# EAGLE design cortina (EAGLE 9.6.2)
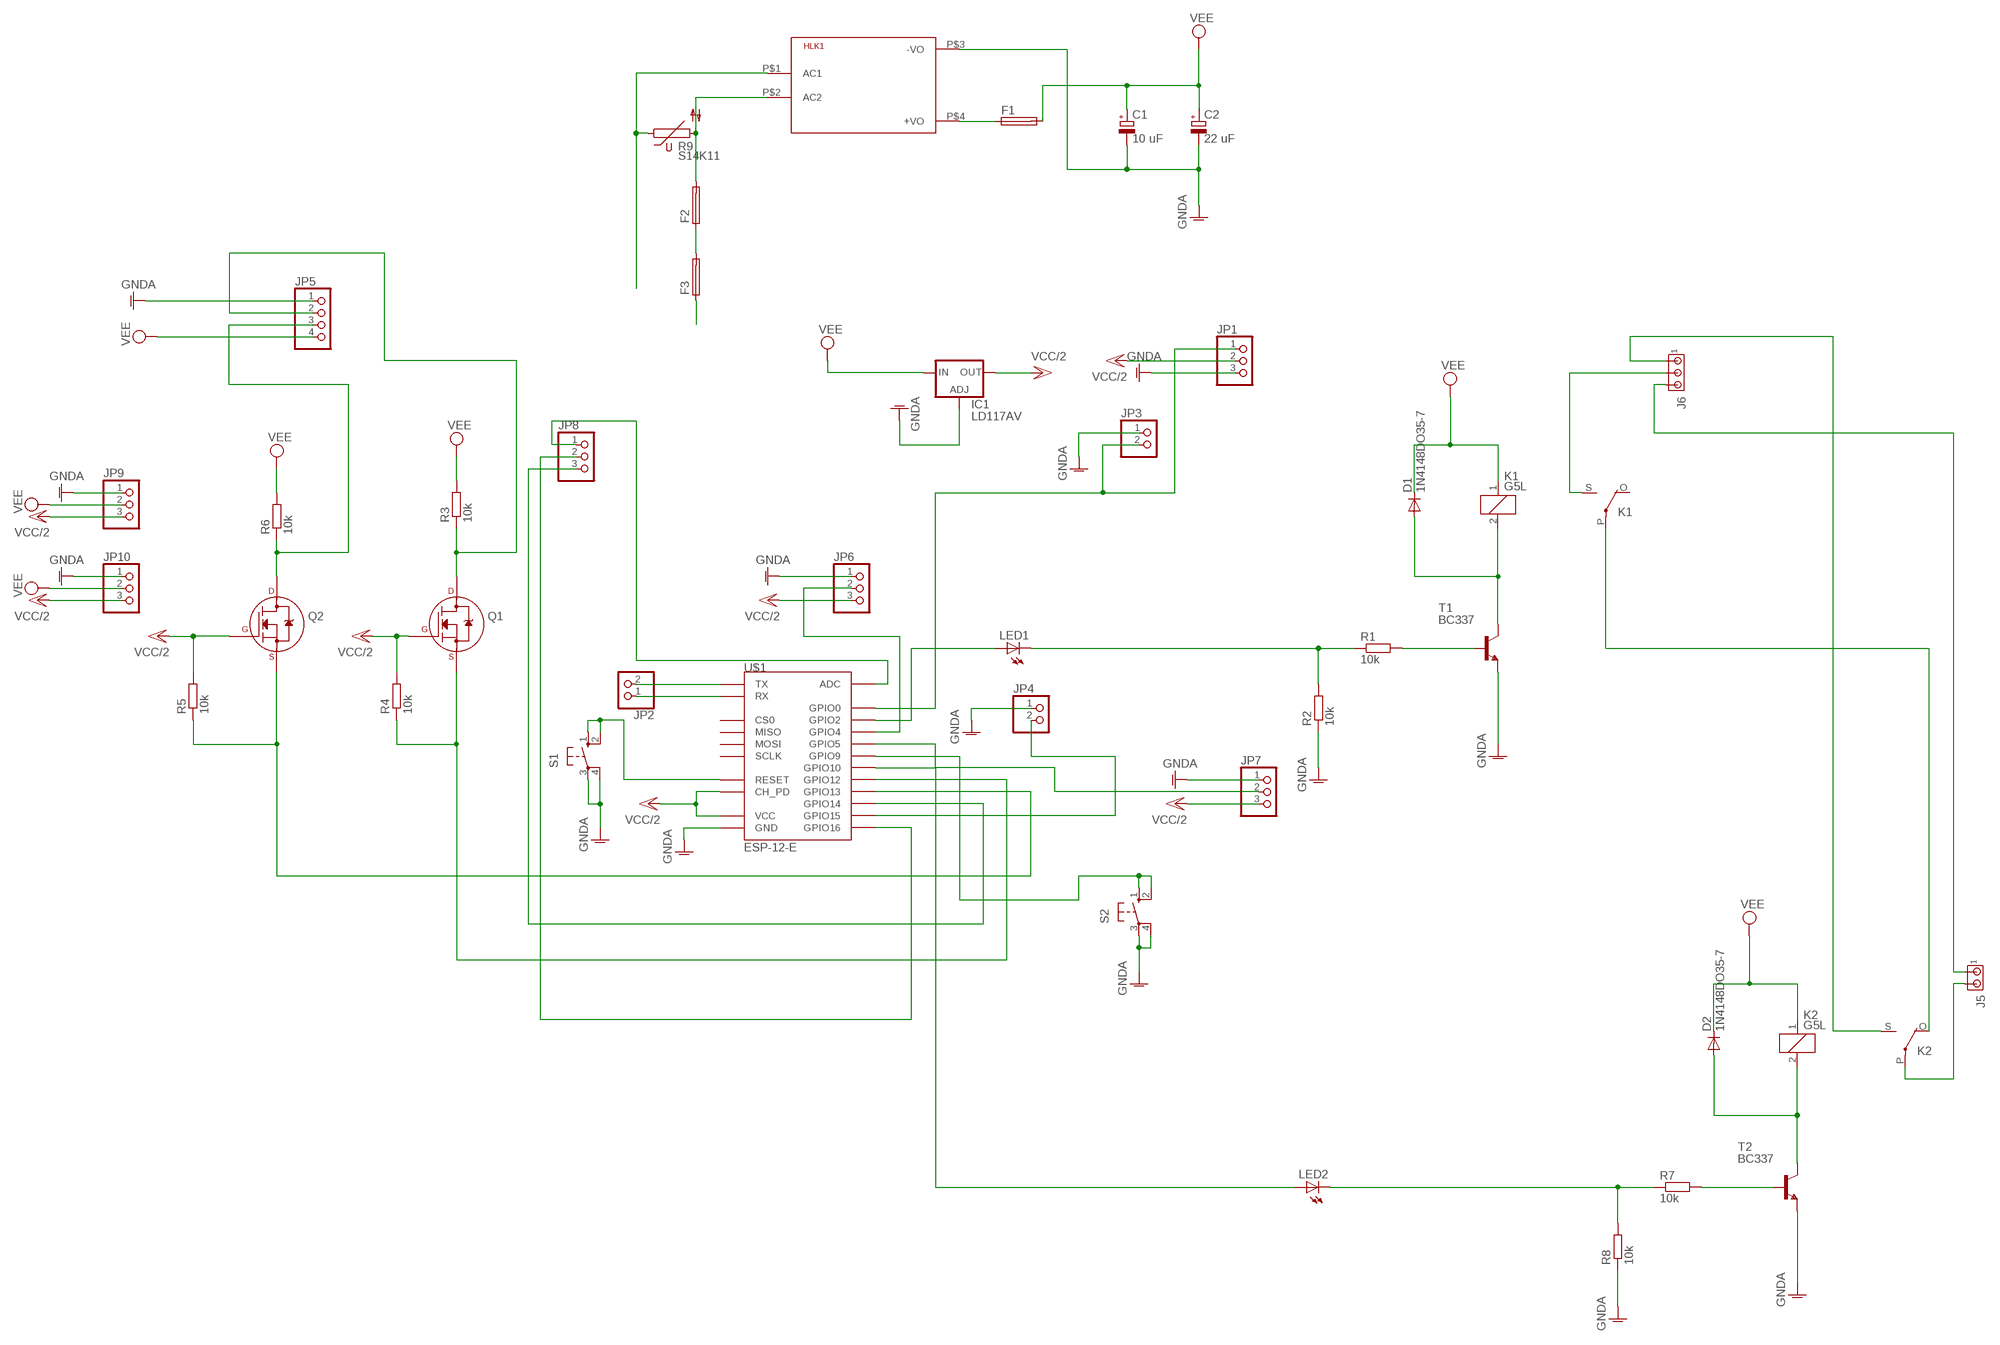
[diagram p0: schematic, sheet 1]

## Parts
C1  10 uF  CPOL-EUE1.8-4  [E1,8-4]
C2  22 uF  CPOL-EUE1.8-4  [E1,8-4]
D1  1N4148DO35-7  [DO35-7]
D2  1N4148DO35-7  [DO35-7]
F1  GSH15  [GSH15]
F2  GSH15  [GSH15]
F3  GSH15  [GSH15]
HLK1  HLK-PM013W  [HLK-PM01]
IC1  LD117AV  [TO220L1]
J5  MTA02-156  [1X2MTA]
J6  MTA03-156  [1X3MTA]
JP1  PINHD-1X3  [1X03]
JP2  PINHD-1X2  [1X02]
JP3  PINHD-1X2  [1X02]
JP4  PINHD-1X2  [1X02]
JP5  PINHD-1X4  [1X04]
JP6  PINHD-1X3  [1X03]
JP7  PINHD-1X3  [1X03]
JP8  PINHD-1X3  [1X03]
JP9  PINHD-1X3  [1X03]
JP10  PINHD-1X3  [1X03]
K1  G5L  [G5LE]
K2  G5L  [G5LE]
LED1  LED5MM  [LED5MM]
LED2  LED5MM  [LED5MM]
Q1  2N7002_TO92  [TO-92]
Q2  2N7002_TO92  [TO-92]
R1  10k  R-EU_0207/7  [0207/7]
R2  10k  R-EU_0207/7  [0207/7]
R3  10k  R-EU_0207/7  [0207/7]
R4  10k  R-EU_0207/7  [0207/7]
R5  10k  R-EU_0207/7  [0207/7]
R6  10k  R-EU_0207/7  [0207/7]
R7  10k  R-EU_0207/7  [0207/7]
R8  10k  R-EU_0207/7  [0207/7]
R9  S14K11  [S14K11]
S1  10-XX  [B3F-10XX]
S2  10-XX  [B3F-10XX]
T1  BC337  [TO92]
T2  BC337  [TO92]
U$1  ESP-12-E  [ESP-12-E]

## Nets
GNDA: C1.- C2.- HLK1.P$3(-VO) IC1.1(ADJ) JP1.3 JP3.1 JP4.1 JP5.1 JP6.1 JP7.1 JP9.1 JP10.1 R2.1 R8.1 S1.3(P) S1.4(P1) S2.3(P) S2.4(P1) T1.1(E) T2.1(E) U$1.GND
N$1 [power]: HLK1.P$1(AC1) J5.1 J6.3 R9.1
N$2: LED1.A U$1.GPIO2
N$3: JP1.1 JP3.2 U$1.GPIO0
N$4: LED1.K(C) R1.1 R2.2
N$5: JP2.2 U$1.TX
N$6: D1.A K1.2 T1.3(C)
N$7: R1.2 T1.2(B)
N$8: J6.2 K1.S(2:S)
N$9 [power]: K1.P(2:P) K2.O(2:O)
N$10: JP2.1 U$1.RX
N$11: Q1.1(S) R4.1 U$1.GPIO12
N$12: JP5.2 Q1.3(D) R3.1
N$13: D2.A K2.2 T2.3(C)
N$14: Q2.1(S) R5.1 U$1.GPIO13
N$15: JP5.3 Q2.3(D) R6.1
N$16: JP4.2 U$1.GPIO15
N$17: JP6.2 U$1.GPIO4
N$18: JP7.2 LED2.A U$1.GPIO5 U$1.GPIO10
N$19: JP8.1 U$1.ADC
N$20: JP8.3 U$1.GPIO14
N$21: JP8.2 U$1.GPIO16
N$22: R7.2 T2.2(B)
N$23: F1.1 HLK1.P$4(+VO)
N$24: J6.1 K2.S(2:S)
N$25 [power]: F3.1 J5.2 K2.P(2:P)
N$26: LED2.K(C) R7.1 R8.2
N$27: F2.1 F3.2
N$28: F2.2 HLK1.P$2(AC2) R9.2
N$29: S1.1(S) S1.2(S1) U$1.RESET
N$32: S2.1(S) S2.2(S1) U$1.GPIO9
VCC/2: IC1.2(OUT) JP1.2 JP6.3 JP7.3 JP9.3 JP10.3 Q1.2(G) Q2.2(G) R4.2 R5.2 U$1.CH_PD U$1.VCC
VEE: C1.+ C2.+ D1.C D2.C F1.2 IC1.3(IN) JP5.4 JP9.2 JP10.2 K1.1 K2.1 R3.2 R6.2
Unconnected: K1.O(2:O) U$1.CS0 U$1.MISO U$1.MOSI U$1.SCLK

## Library data of the parts
C1 C2 = rcl:CPOL-EU: POLARIZED CAPACITOR, European symbol; SPICEPREFIX: C
D1 D2 = diode:1N4148: DIODE high speed (Philips)
F1-F3 = fuse:GSH15: FUSE HOLDER grid 15mm, 19649 Wickmann; MPN: 64900001039; OC_FARNELL: 1271673; OC_NEWARK: 02P0318
HLK1 = HLK-PM01:HLK-PM01: Hi-Link Power Supply HLK-PM01 3W Author: Ahmed Said <https://github.com/AhmedSaid/EAGLELibraries>
IC1 = v-reg:LD117A?*: Low drop fixed and adjustable positive voltage regulators 1 A Source: http://www.st.com/stonline/products/literature/ds/7194/ld1117axx.pdf
J5 = con-amp:MTA02-156: AMP connector
J6 = con-amp:MTA03-156: AMP connector
JP1 JP6-JP10 = pinhead:PINHD-1X3: PIN HEADER
JP2-JP4 = pinhead:PINHD-1X2: PIN HEADER
JP5 = pinhead:PINHD-1X4: PIN HEADER
K1 K2 = relay:G5L: RELAY 1 x switch, 10 A/120 V AC, 8 A/30 V ADC, Omron; OC_FARNELL: unknown; OC_NEWARK: unknown
LED1 LED2 = adafruit:LED: LED OSRAM: - CHIPLED LG R971, LG N971, LY N971, LG Q971, LY Q971, LO R971, LY R971 LH N974, LH R974 LS Q976, LO Q976, LY Q976 LO Q996 - Hyper CHIPLED LW Q18S LB Q993, LB Q99A, LB R99A - SideLED LS A670, LO A670, LY A670, LG A670, LP A670 LB A673, LV A673, LT A673, LW A673 LH A674 LY A675 LS A676, LA A676, LO A676, LY A676, LW A676 LS A679, LY A679, LG A679 - Hyper Micro SIDELED® LS Y876, LA Y876, LO Y876, LY Y876 LT Y87S - SmartLED LW L88C, LW L88S LB L89C, LB L89S, LG L890 LS L89K, LO L89K, LY L89K LS L896, LA L896, LO L896, LY L896 - TOPLED LS T670, LO T670, LY T670, LG T670, LP T670 LSG T670, LSP T670, LSY T670, LOP T670, LYG T670 LG T671, LOG T671, LSG T671 LB T673, LV T673, LT T673, LW T673 LH T674 LS T676, LA T676, LO T676, LY T676, LB T676, LH T676, LSB T676, LW T676 LB T67C, LV T67C, LT T67C, LS T67K, LO T67K, LY T67K, LW E67C LS E67B, LA E67B, LO E67B, LY E67B, LB E67C, LV E67C, LT E67C LW T67C LS T679, LY T679, LG T679 LS T770, LO T770, LY T770, LG T770, LP T770 LB T773, LV T773, LT T773, LW T773 LH T774 LS E675, LA E675, LY E675, LS T675 LS T776, LA T776, LO T776, LY T776, LB T776 LHGB T686 LT T68C, LB T68C - Hyper Mini TOPLED® LB M676 - Mini TOPLED Santana® LG M470 LS M47K, LO M47K, LY M47K Source: http://www.osram.convergy.de/
Q1 Q2 = transistors:2N700*: 2N7000, 2N7002, NDS7002A N-channel enhancement mode MOSFET
R1-R8 = resistor:R-EU_: RESISTOR, European symbol
R9 = varistor:S14K11: VARISTOR
S1 S2 = switch-omron:10-XX: OMRON SWITCH; MPN: B3F-1000; OC_FARNELL: 176432; OC_NEWARK: 36M3542
T1 T2 = transistor:BC337: NPN TRANSISTOR
U$1 = johs_esp8266_lib_frank_esp12e_mod:ESP-12-E: ESP8266 Wifi Module ESP-12-E; DIMENSIONS: 24.0 x 16.0 mm; PINS: 22; PITCH: 0.078" / 2 mm; SPICEPREFIX: X

## Net classes
1 power: width 1.016 mm

## Board
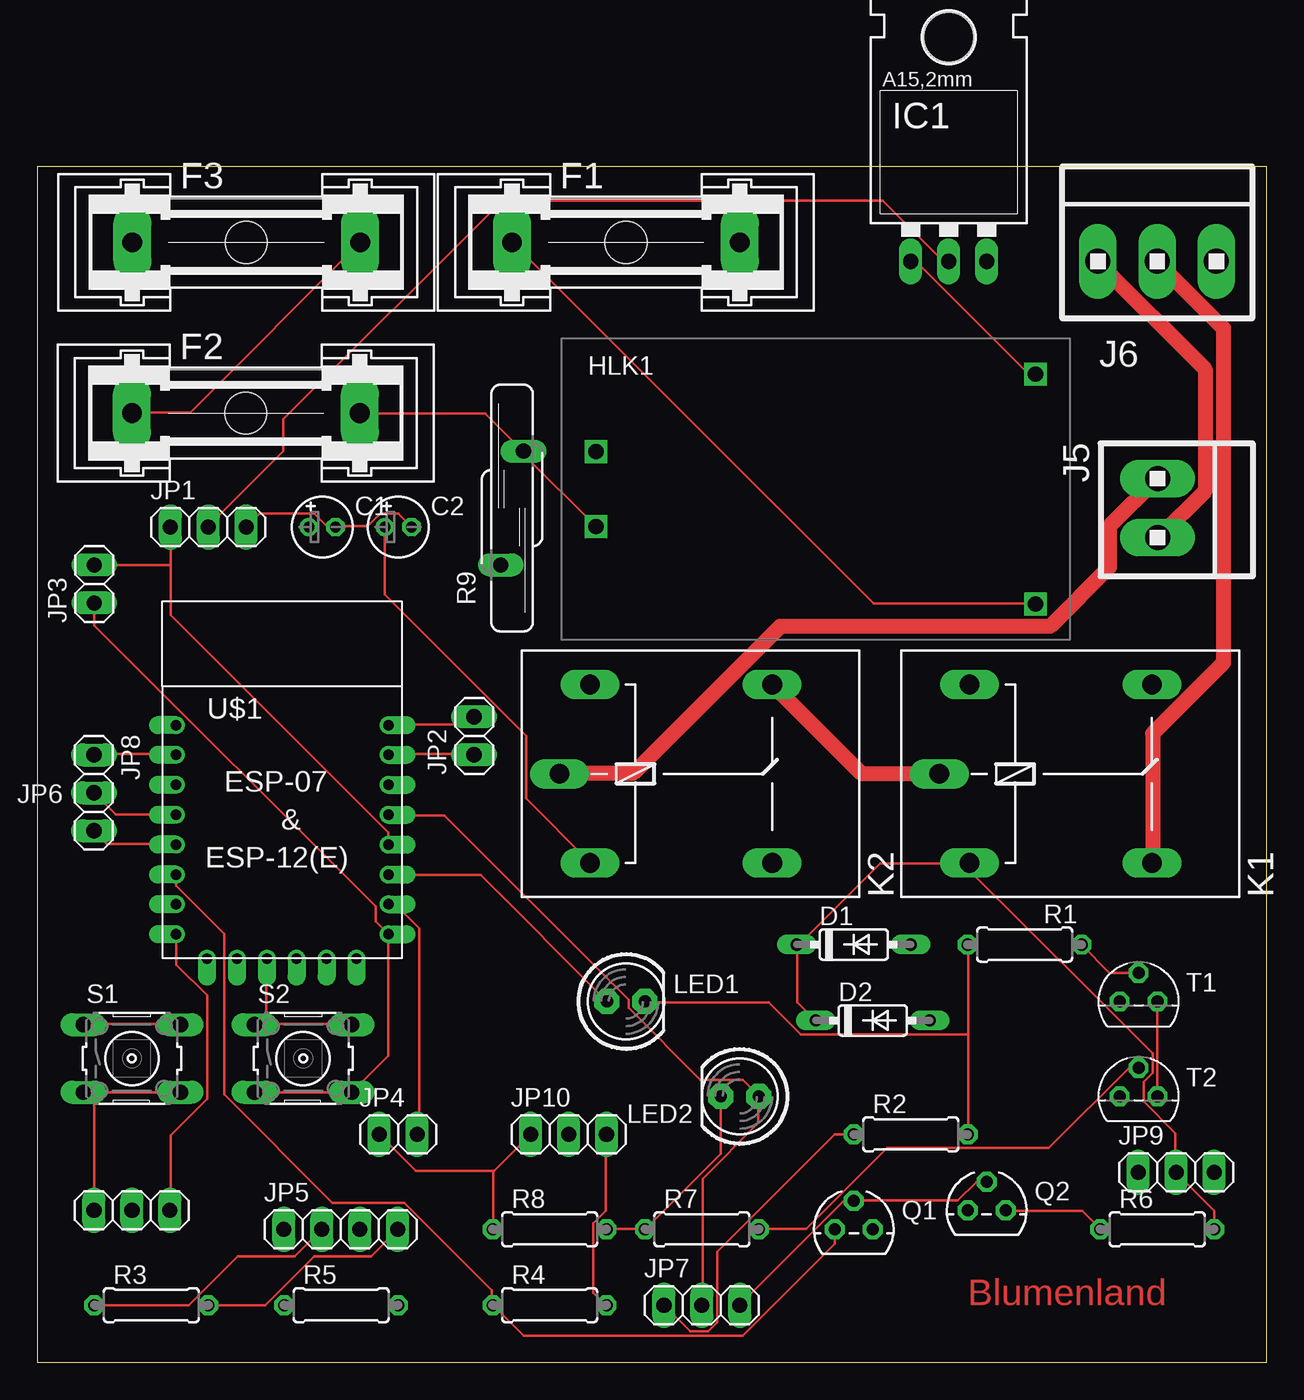
[diagram p1: board, top side]
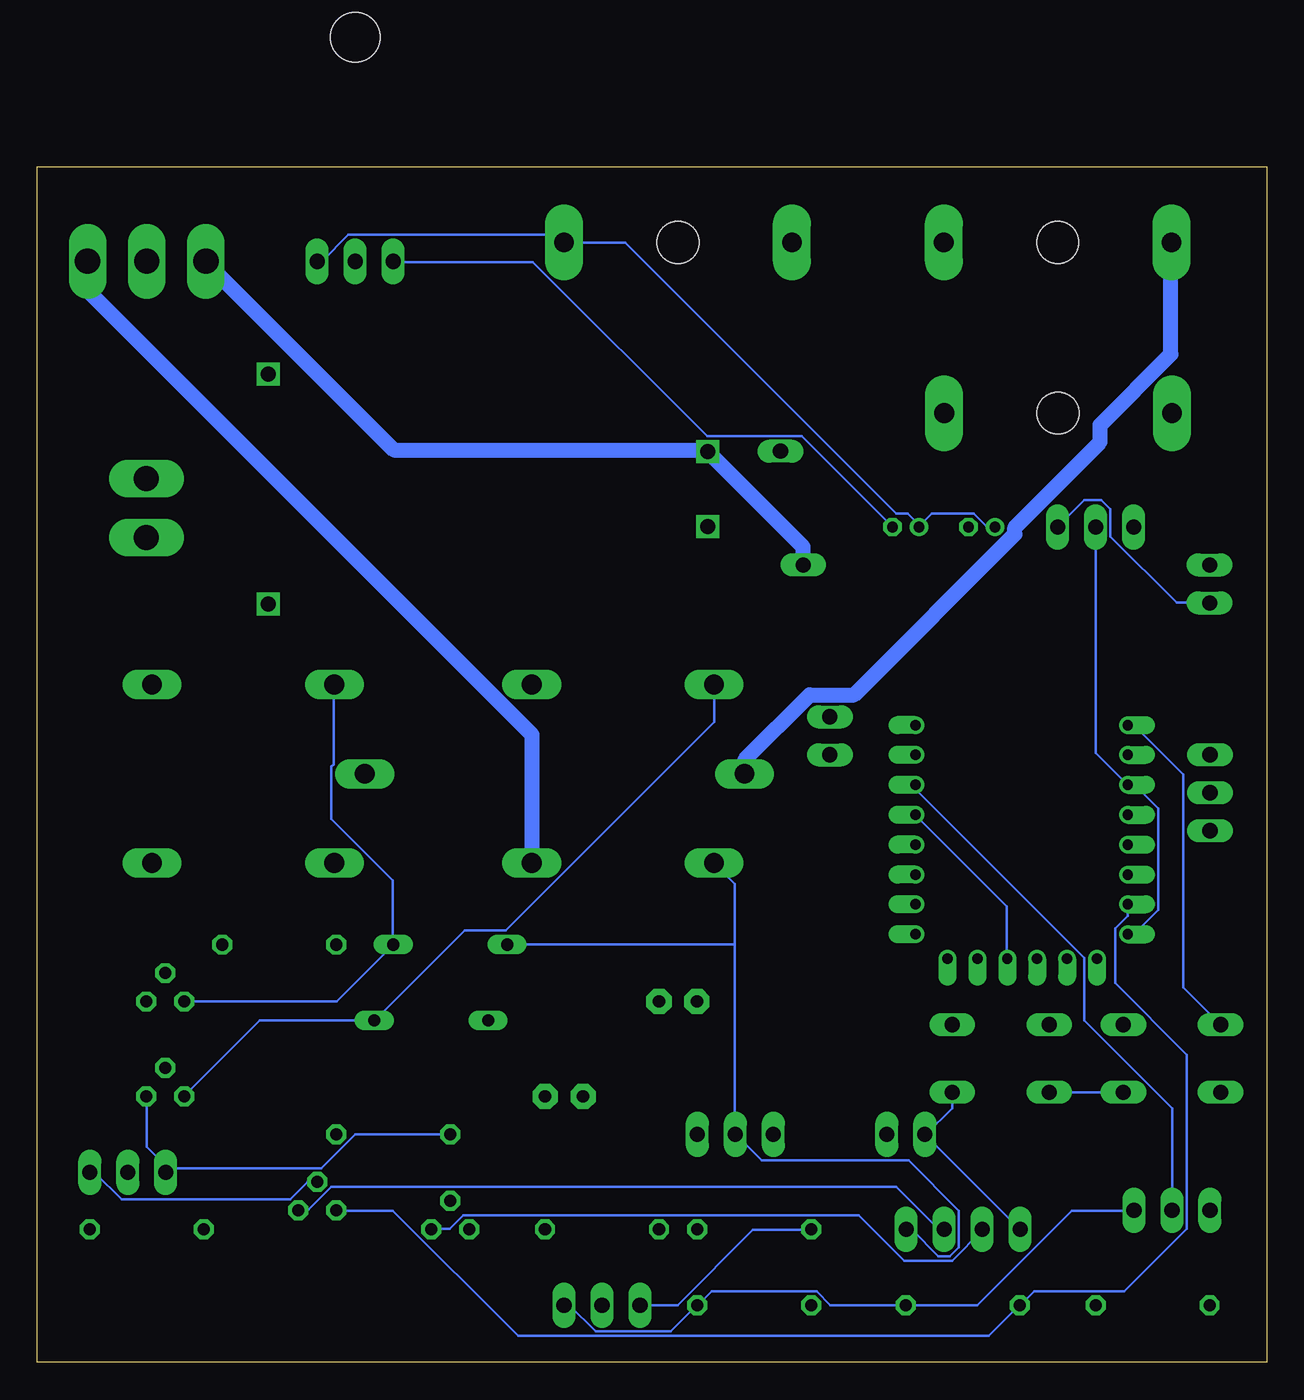
[diagram p2: board, bottom side, seen from below]

Size 82.22 x 80 mm. Coordinates in mm from the lower left corner, seen from the top.
Outline: 0,0 82.22,0 82.22,80 0,80 0,0
Copper layers (1*16): Top 0.035mm / dielectric 1.5mm / Bottom 0.035mm
Design rules "default": minimum track width 6mil, minimum drill 0.35mm, track to track 6mil, track to pad 6mil, pad to pad 6mil, via to via 6mil, smd to smd 6mil, copper to edge 40mil, drill to drill 6mil, minimum pad ring 10mil, minimum via ring 8mil, stop-mask expansion 4mil, vias tented up to drill 0mil, thermal gap 10mil

### Footprints (pad centres in the part's own frame; a part is rotated, then mirrored left to right if it is on the bottom)
E1,8-4 = drill 0.711 pad 1.168: + -0.889,0 | drill 0.711 pad 1.168 octagon: - 0.889,0
DO35-7 = drill 0.813 long: A 3.81,0; C -3.81,0
GSH15 = drill 1.321 pad 2.54 long: 1 -7.62,0; 2 7.62,0 | hole 2.794: 0,0
HLK-PM01 = drill 1.016 square: P$1 -14.7,2.5; P$2 -14.7,-2.5; P$3 14.7,7.7; P$4 14.7,-7.7
TO220L1 = drill 1.016 long: 1 -2.54,-3.81; 2 0,-3.81; 3 2.54,-3.81 | hole 3.302: 0,11.176
1X2MTA = drill 1.676 long: 1 1.981,0; 2 -1.981,0
1X3MTA = drill 1.676 long: 1 3.937,0; 2 -0.025,0; 3 -3.988,0
1X03 = drill 1.016 long: 1 -2.54,0; 2 0,0; 3 2.54,0
1X02 = drill 1.016 long: 1 -1.27,0; 2 1.27,0
1X04 = drill 1.016 long: 1 -3.81,0; 2 -1.27,0; 3 1.27,0; 4 3.81,0
G5LE = drill 1.321 long: 1 -7.493,-5.969; 2 -7.493,5.969; O 4.699,5.969; P -9.525,0; S 4.699,-5.969
LED5MM = drill 0.813 pad 1.676 octagon: A -1.27,0; K 1.27,0
TO-92 = drill 0.813 octagon: 1 -1.27,0; 2 0,1.905; 3 1.27,0
0207/7 = drill 0.813 octagon: 1 -3.81,0; 2 3.81,0
S14K11 = drill 1.016 long: 1 -0.762,-3.81; 2 0.762,3.81
B3F-10XX = drill 1.016 long: 1 -3.251,2.261; 2 3.251,2.261; 3 -3.251,-2.261; 4 3.251,-2.261
TO92 = drill 0.813 octagon: 1 1.27,0; 2 0,1.905; 3 -1.27,0
ESP-12-E = drill 0.7 offset: ADC -7.2,3.8; CH_PD -7.2,1.8; CS0 -5.14,-9.838; GND 7,-8.2; GPIO0 7,-2.2; GPIO2 7,-4.2; GPIO4 7,1.8; GPIO5 7,-0.2; GPIO9 -1.14,-9.838; GPIO10 0.86,-9.838; GPIO12 -7.2,-4.2; GPIO13 -7.2,-6.2; GPIO14 -7.2,-2.2; GPIO15 7,-6.2; GPIO16 -7.2,-0.2; MISO -3.14,-9.838; MOSI 2.86,-9.838; RESET -7.2,5.8; RX 7,3.8; SCLK 4.86,-9.838; TX 7,5.8; VCC -7.2,-8.2

### Placement (x,y rotation side)
C1  19.05,55.88 0 top
C2  24.13,55.88 0 top
D1  54.61,27.94 0 top
D2  55.88,22.86 0 top
F1  39.37,74.93 0 top
F2  13.94,63.5 0 top
F3  13.97,74.93 0 top
HLK1  52.07,58.42 0 top
IC1  60.96,77.47 0 top
J5  74.93,57.15 270 top
J6  74.93,73.66 0 top
JP1  11.43,55.88 0 top
JP2  29.21,41.91 90 top
JP3  3.81,52.07 90 top
JP4  24.13,15.24 0 top
JP5  20.29,8.89 0 top
JP6  6.32,10.16 0 top
JP7  44.45,3.81 0 top
JP8  3.78,38.1 270 top
JP9  76.17,12.7 0 top
JP10  35.53,15.24 0 top
K1  69.85,39.37 0 top
K2  44.45,39.37 0 top
LED1  39.37,24.13 0 top
LED2  46.99,17.78 180 top
Q1  54.61,8.89 0 top
Q2  63.5,10.16 0 top
R1  66.04,27.94 0 top
R2  58.42,15.24 0 top
R3  7.62,3.81 0 top
R4  34.26,3.81 0 top
R5  20.32,3.81 0 top
R6  74.9,8.89 0 top
R7  44.45,8.89 0 top
R8  34.26,8.89 0 top
R9  31.75,57.15 0 top
S1  6.32,20.32 0 top
S2  17.78,20.32 0 top
T1  73.66,24.13 0 top
T2  73.66,17.78 0 top
U$1  16.48,36.83 0 top

### Tracks (layer width: path | path; a pad name or v marks a point on that pad's centre or on a via)
GNDA
  Top 0.152: IC1.1 58.45,73.61 58.83,73.61 66.29,66.14 66.75,66.14 HLK1.P$3 | C2.- 24.99,55.93 24.16,56.77 22.94,56.77 22.1,55.93 19.96,55.93 C1.- 19.89,55.93 19.35,55.93 18.52,56.77 14.86,56.77 JP1.3 | T1.1 74.91,24.08 74.91,17.83 T2.1 | JP10.1 30.52,12.76 | 30.52,12.76 30.48,12.72 30.48,8.91 R8.1 | S1.4 3.81,18.06 | 3.81,18.06 S1.3 3.12,18.06 | 3.81,18.06 3.81,10.21 JP6.1 | S2.3 S2.4 23.47,20.5 23.47,28.57 U$1.GND 23.47,28.65 22.63,29.49 22.63,30.48 3.81,49.3 JP3.1 | JP4.1 25.3,12.8 30.48,12.8 30.52,12.76 | R2.1 53.34,15.24 45.49,7.39 45.49,2.67 44.88,2.06 43.66,2.06 JP7.1
  Bottom 0.152: JP3.1 3.81,50.83 6.02,50.83 10.44,55.24 10.44,57.07 11.05,57.68 12.19,57.68 13.94,55.93 JP1.3 | C2.- 31.09,61.95 37.41,61.95 49.07,73.61 58.37,73.61 IC1.1 | R2.1 60.96,15.24 63.25,12.95 73.38,12.95 JP9.1 73.46,12.95 74.91,14.4 74.91,17.75 T2.1 | JP7.1 39.39,3.81 34.37,8.84 30.48,8.84 R8.1 | S1.4 S2.3 | JP5.1 16.53,8.91 JP4.1 22.78,15.24 21.03,16.99 S2.4
N$1
  Top 1.016: J5.1 74.98,55.17 78.11,58.29 78.11,66.45 70.94,73.61 J6.3
  Bottom 1.016: R9.1 31.01,53.34 31.01,54.56 37.34,60.88 HLK1.P$1 37.87,61.04 58.37,61.04 70.94,73.61 J6.3
N$2
  Top 0.152: U$1.GPIO2 23.55,32.61 29.64,32.61 38.1,24.16 LED1.A
N$3
  Top 0.152: 8.92,53.34 8.92,55.85 JP1.1 | 8.92,53.34 8.92,49.99 23.47,35.43 23.47,34.67 U$1.GPIO0 | 8.92,53.34 JP3.2
N$4
  Top 0.152: 62.26,21.95 62.26,27.89 R1.1 | 62.26,21.95 62.26,15.24 R2.2 | 62.26,21.95 51.05,21.95 48.92,24.08 40.69,24.08 LED1.K
N$5
  Top 0.152: U$1.TX 23.55,42.67 28.73,42.67 29.18,43.13 JP2.2
N$6
  Bottom 0.152: T1.3 72.39,24.16 62.18,24.16 58.45,27.89 D1.A 58.45,27.96 58.45,32.23 62.56,36.35 62.56,39.85 62.41,40.01 62.41,45.34 K1.2
N$7
  Top 0.152: T1.2 73.61,26.06 71.7,26.06 69.88,27.89 R1.2
N$8
  Top 1.016: K1.S 74.6,33.45 74.6,42.06 79.32,46.79 79.32,69.19 74.91,73.61 J6.2
N$9
  Top 1.016: K2.O 55.09,39.4 60.27,39.4 K1.P
N$10
  Top 0.152: U$1.RX 23.55,40.69 29.18,40.69 JP2.1
N$11
  Top 0.152: U$1.GPIO12 9.3,32.61 9.3,31.85 12.5,28.65 12.5,17.91 19.74,10.67 24.54,10.67 30.4,4.8 30.4,3.81 R4.1 30.48,3.81 32.54,1.75 47.17,1.75 53.34,7.92 Q1.1
N$12
  Top 0.152: R3.1 10.13,3.81 13.41,7.09 17.22,7.09 JP5.2
  Bottom 0.152: Q1.3 55.85,8.91 54.63,8.91 53.72,9.83 27.28,9.83 24.23,6.78 21.03,6.78 18.97,8.84 JP5.2
N$13
  Bottom 0.152: T2.3 72.39,17.83 67.36,22.86 D2.A 59.66,22.86 53.65,28.88 50.9,28.88 36.96,42.82 K2.2
N$14
  Bottom 0.152: U$1.GPIO13 9.3,30.56 9.3,29.87 10.13,29.03 10.13,25.38 5.33,20.57 5.33,8.91 9.53,4.72 15.54,4.72 16.46,3.81 R5.1 16.53,3.81 18.59,1.75 50.06,1.75 58.45,10.13 62.18,10.13 Q2.1
N$15
  Top 0.152: Q2.3 64.77,10.13 69.88,10.13 71.09,8.91 R6.1
  Bottom 0.152: JP5.3 21.56,8.91 21.95,8.91 24.77,11.73 62.56,11.73 64.08,10.21 64.77,10.21 Q2.3
N$16
  Top 0.152: U$1.GPIO15 23.55,30.56 24,30.56 25.53,29.03 25.53,15.32 25.45,15.24 JP4.2
N$17
  Bottom 0.152: JP6.2 6.33,16.99 12.19,22.86 12.19,27.05 23.47,38.33 23.47,38.56 U$1.GPIO4
N$18
  Top 0.152: JP7.2 44.5,3.81 44.5,12.27 48.23,16 48.23,17.75 LED2.A 48.23,17.83 47.17,18.9 44.35,18.9 39.55,23.7 39.55,24.23 27.2,36.58 23.55,36.58 U$1.GPIO5
  Bottom 0.152: U$1.GPIO10 17.37,27.05 17.37,30.48 23.47,36.58 U$1.GPIO5
N$19
  Top 0.152: U$1.ADC 9.22,40.69 3.81,40.69 JP8.1
N$20
  Top 0.152: U$1.GPIO14 9.22,34.67 4.65,34.67 3.81,35.51 JP8.3
N$21
  Top 0.152: U$1.GPIO16 9.22,36.65 5.26,36.65 3.81,38.1 JP8.2
N$22
  Top 0.152: R7.2 48.31,8.91 51.43,8.91 56.84,14.33 67.67,14.33 73,19.66 73.61,19.66 T2.2
N$23
  Top 0.152: F1.1 55.93,50.75 66.75,50.75 HLK1.P$4
N$24
  Bottom 1.016: K2.S 49.15,41.99 78.87,71.7 J6.1
N$25
  Top 1.016: K2.P 34.98,39.4 39.85,39.4 49.68,49.23 67.74,49.23 71.7,53.19 71.7,55.93 74.91,59.13 J5.2
  Bottom 1.016: F3.1 6.4,74.91 6.4,67.44 11.12,62.71 11.12,61.57 16.84,55.85 16.84,55.4 27.58,44.65 30.56,44.65 34.9,40.31 34.9,39.4 K2.P
N$26
  Top 0.152: R8.2 38.1,8.91 40.61,8.91 R7.1 40.69,8.91 45.72,13.95 LED2.K
N$27
  Top 0.152: F3.2 10.21,63.55 6.33,63.55 F2.1
N$28
  Top 0.152: HLK1.P$2 37.34,55.93 32.54,60.73 32.54,60.96 R9.2 32.46,60.96 29.95,63.48 21.56,63.48 F2.2
N$29
  Top 0.152: S1.2 9.53,22.63 3.12,22.63 S1.1
  Bottom 0.152: S1.1 5.56,25.07 5.56,39.32 8.84,42.6 9.22,42.6 U$1.RESET
N$32
  Top 0.152: U$1.GPIO9 15.32,26.98 15.32,23.39 14.55,22.63 S2.1 15.32,23.32 16,22.63 21.03,22.63 S2.2
VCC/2
  Top 0.152: Q2.2 63.48,12.04 62.79,12.04 61.57,10.82 54.63,10.82 Q1.2 54.56,10.74 53.87,10.74 46.94,3.81 JP7.3 | JP10.3 38.02,15.24 38.02,10.13 37.19,9.3 37.19,4.65 38.02,3.81 R4.2 | IC1.2 60.96,73.69 60.58,73.69 56.54,77.72 31.09,77.72 16.46,63.09 16.46,60.96 11.43,55.93 JP1.2 | JP6.3 8.92,10.21 8.92,15.16 11.35,17.6 11.35,24.54 9.3,26.59 9.3,28.57 U$1.VCC
  Bottom 0.152: JP9.3 78.72,12.65 78.33,12.65 76.58,10.9 65.3,10.9 64.16,12.04 63.55,12.04 Q2.2 | JP6.3 8.92,10.13 13.03,10.13 19.35,3.81 R5.2 29.18,3.81 30.1,4.72 37.11,4.72 38.02,3.81 R4.2 38.1,3.81 39.85,2.06 44.88,2.06 46.63,3.81 JP7.3 | U$1.VCC 9.22,28.65 8.84,28.65 7.24,30.25 7.24,37.03 8.76,38.56 9.22,38.56 U$1.CH_PD 9.3,38.63 11.43,40.77 JP1.2
VEE
  Top 0.152: R6.2 78.72,10.13 76.2,12.65 JP9.2 76.12,12.72 76.12,15.32 73.99,17.45 73.99,18.75 74.6,19.36 74.6,20.65 62.41,32.84 62.41,33.38 K1.1 62.33,33.38 56.39,33.38 50.9,27.89 D1.C 50.82,27.89 50.82,24.08 52.04,22.86 D2.C | R3.2 15.24,3.81 18.52,7.09 22.33,7.09 24.08,8.84 JP5.4 | C2.+ 23.24,51.36 32.69,41.91 32.69,37.72 36.96,33.45 K2.1
  Bottom 0.152: IC1.3 63.48,73.69 63.17,73.69 61.42,75.44 47.47,75.44 47.02,74.98 F1.2 46.94,74.91 42.9,74.91 24.77,56.77 24,56.77 23.24,56.01 C2.+ 23.24,55.93 22.4,56.77 19.58,56.77 18.74,55.93 18.21,55.93 C1.+ | 35.59,27.96 35.59,32 36.96,33.38 K2.1 | 35.59,27.96 35.59,15.24 JP10.2 35.51,15.24 33.76,13.49 23.93,13.49 20.57,10.13 20.57,7.7 21.18,7.09 21.95,7.09 23.7,8.84 24.08,8.84 JP5.4 | 35.59,27.96 50.75,27.96 D1.C

### Text on the board
Top: Blumenland